# EasyEDA schematic schematic_easy_eda.json
TITLE: MDP-M01; Date: 2025-01-01; Sheet: 1/1; Drawn By: Nikolas Saf
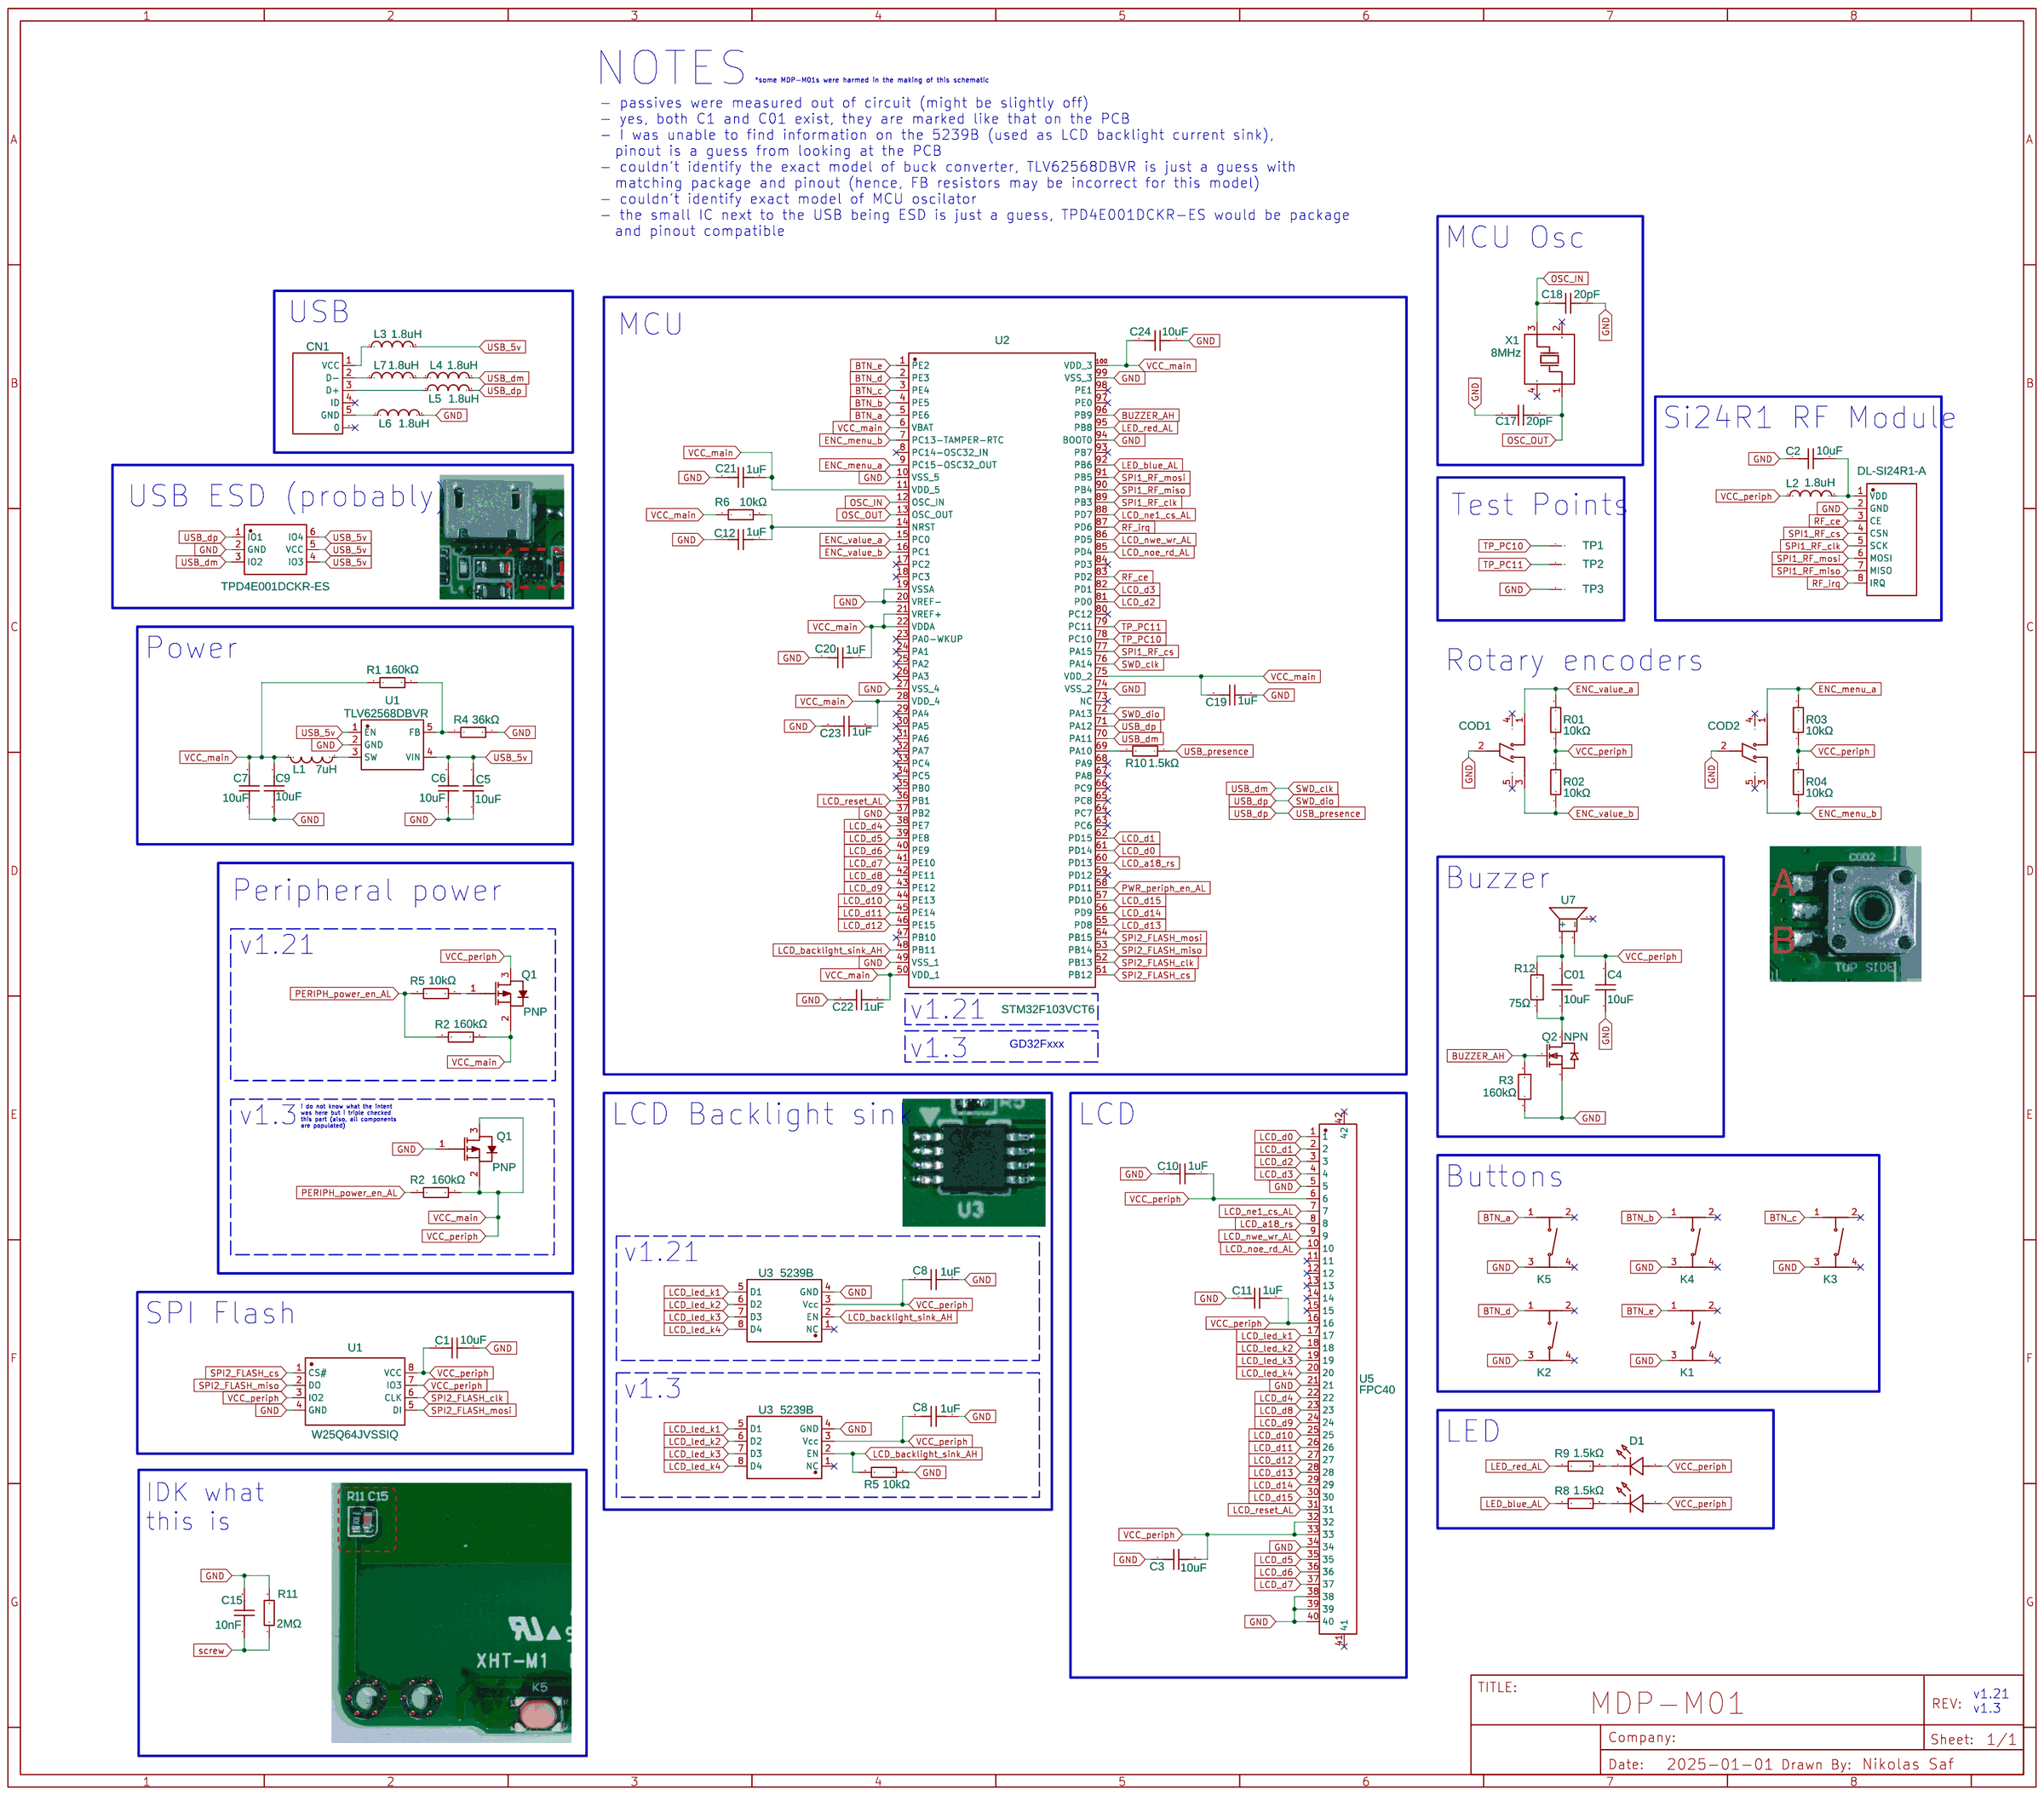
[diagram p0: schematic sheet]

## Parts
C01  10uF  [C0603]
C2  10uF  [C0603]
C3  10uF  [C0603]
C4  10uF  [C0603]
C5  10uF  [C0603]
C6  10uF  [C0603]
C7  10uF  [C0603]
C8  1uF  [C0603]
C8#2  1uF  [C0603]
C9  10uF  [C0603]
C10  1uF  [C0603]
C11  1uF  [C0603]
C12  1uF  [C0603]
C15  10nF  [C0603]
C17  20pF  [C0603]
C18  20pF  [C0603]
C19  1uF  [C0603]
C20  1uF  [C0603]
C21  1uF  [C0603]
C22  1uF  [C0603]
C23  1uF  [C0603]
C24  10uF  [C0603]
CN1  Micro USB-B 5P_C40942  [MICRO-USB-SMD_5P-P0.65-H-M_MICRO-USB-5P]
COD1  CEN808012W02  [SW-SMD_KAILH_CEN652812A02]
COD2  CEN808012W02  [SW-SMD_KAILH_CEN652812A02]
D1  XL-1615SURUBC  [LED-ARRAY-SMD_4P-L1.6-W1.5-TL-1]
D2  TPD4E001DCKR-ES  [SC-70-6_L2.0-W1.3-P0.65-LS2.1-BL]
K1  TBFF22KQR  [SW-SMD_4P-L3.5-W2.9-P1.45-LS4.7_TBFF22KQR]
K2  TBFF22KQR  [SW-SMD_4P-L3.5-W2.9-P1.45-LS4.7_TBFF22KQR]
K3  TBFF22KQR  [SW-SMD_4P-L3.5-W2.9-P1.45-LS4.7_TBFF22KQR]
K4  TBFF22KQR  [SW-SMD_4P-L3.5-W2.9-P1.45-LS4.7_TBFF22KQR]
K5  TBFF22KQR  [SW-SMD_4P-L3.5-W2.9-P1.45-LS4.7_TBFF22KQR]
L1  7uH  [L1206]
L2  1.8uH  [L1206]
L3  1.8uH  [L1206]
L4  1.8uH  [L1206]
L5  1.8uH  [L1206]
L6  1.8uH  [L1206]
L7  1.8uH  [L1206]
Q1  PNP  [SOT-23-3_L3.0-W1.7-P0.95-LS2.9-BR]
Q1#2  PNP  [SOT-23-3_L3.0-W1.7-P0.95-LS2.9-BR]
Q2  NPN  [SOT-23-3_L2.9-W1.6-P1.90-LS2.8-BR]
R01  10kΩ  [R0603]
R02  10kΩ  [R0603]
R2#2  160kΩ  [R0603]
R3  160kΩ  [R0603]
R04  10kΩ  [R0603]
R5  10kΩ  [R0603]
R5#2  10kΩ  [R0603]
R6  10kΩ  [R0603]
R8  1.5kΩ  [R0603]
R9  1.5kΩ  [R0603]
R10  1.5kΩ  [R0603]
R11  2MΩ  [R0603]
R12  75Ω  [R0603]
TP1  TEST_TESTPOINT  [TEST_TESTPOINT]
TP2  TEST_TESTPOINT  [TEST_TESTPOINT]
TP3  TEST_TESTPOINT  [TEST_TESTPOINT]
U1  W25Q64JVSSIQ  [SOP-8_L5.3-W5.3-P1.27-LS8.0-BL]
U1#2  TLV62568DBVR  [SOT-23-5_L3.0-W1.7-P0.95-LS2.8-BR]
U2  STM32F103VCT6  [LQFP-100_L14.0-W14.0-P0.50-LS16.0-BL]
U3  5239B  [SOT505-2-8P_L3.0-W3.0-P0.65-LS4.00-BR]
U3#2  5239B  [SOT505-2-8P_L3.0-W3.0-P0.65-LS4.00-BR]
U4  DL-SI24R1-A  [WIRELM-SMD_DL-SI24R1-A]
U5  FPC40  [FPC-SMD_40P-P0.50_C9900008958]
U7  4000Hz  [BUZ-SMD_L5.0-W5.5-P4.60]
X1  8MHz  [CRYSTAL-SMD_4P-L3.2-W2.5-BL-2]

## Library data of the parts
C01-C8 C8#2 C9-C12 C15 C17-C24 = CL10A106MQ8NNNC: Supplier: LCSC; Manufacturer: SAMSUNG(三星); Supplier Part: C1691; JLCPCB Part Class: Extended Part
CN1 = Micro USB-B 5P_C40942: Supplier: LCSC; Manufacturer: 精拓金; Manufacturer Part: 920-D62A2021S10100; Supplier Part: C40942; JLCPCB Part Class: Extended Part
COD1 COD2 = CEN652812A02: Contributor: lcsc; Supplier: LCSC; Supplier Part: C400282; Manufacturer: Kailh(凯华); JLCPCB Part Class: Extended Part
D1 = XL-1615SURUBC: Supplier: LCSC; Supplier Part: C965836; Manufacturer: XINGLIGHT(成兴光); JLCPCB Part Class: Extended Part; Contributor: lcsc
D2 = TPD4E001DCKR: Contributor: LCSC; Supplier: LCSC; Supplier Part: C41409243
K1-K5 = TBFF22KQR: Contributor: LCSC; Supplier: LCSC; Supplier Part: C483804; Manufacturer: 圜达; JLCPCB Part Class: Extended Part
L1-L7 = CMI321609X100KT: Supplier: LCSC; Manufacturer: FH(风华); Supplier Part: C1051; JLCPCB Part Class: Extended Part
Q1 Q1#2 = PMV32UP,215: Contributor: LCSC; Supplier: LCSC; Supplier Part: C282569; Manufacturer: Nexperia(安世); JLCPCB Part Class: Extended Part
Q2 = DMN2056U-7: Contributor: LCSC; Supplier: LCSC; Supplier Part: C332302; Manufacturer: DIODES(美台); JLCPCB Part Class: Extended Part
R01 R02 R2#2 R04 R5 R5#2 R6 R8-R11 = 0603WAF1501T5E: Supplier: LCSC; Manufacturer: UNI-ROYAL(厚声); Supplier Part: C22843; JLCPCB Part Class: Basic Part
R3 R12 = ERJ3EKF95R3V: Contributor: LCSC; Supplier: LCSC; Supplier Part: C403406; Manufacturer: PANASONIC(松下); JLCPCB Part Class: Extended Part
TP1-TP3 = TEST_TESTPOINT: Contributor: Tech Guy
U1 = W25Q64JVSSIQ: Supplier: LCSC; Manufacturer: WINBOND(华邦); Supplier Part: C83140; JLCPCB Part Class: Extended Part
U1#2 = TLV62568DBVR: Contributor: LCSC; Supplier: LCSC; Supplier Part: C163219; Manufacturer: TI(德州仪器); JLCPCB Part Class: Extended Part
U2 = STM32F103VCT6: tags: STM32; subpart_no: 2; Supplier Part: C8313; Supplier: LCSC; Manufacturer: ST(意法半导体); JLCPCB Part Class: Extended Part
U3 U3#2 = 5239B: Contributor: Nikolas_s
U4 = DL-SI24R1-A: Contributor: LCSC; Supplier: LCSC; Supplier Part: C2894788; Manufacturer: DreamLNK(骏晔科技); Manufacturer Part: DL-Si24R1-A; JLCPCB Part Class: Extended Part
U5 = FPC40: Contributor: lcsc; Supplier: LCSC; Supplier Part: C9900018161; Manufacturer: null; JLCPCB Part Class: Extended Part
U7 = MLT-5020: Supplier: LCSC; Manufacturer: 华能; Supplier Part: C94598; JLCPCB Part Class: Extended Part
X1 = TAXM8M4RFDCET2T: Contributor: LCSC; Supplier: LCSC; Supplier Part: C403948; Manufacturer: YJX(雅晶鑫); JLCPCB Part Class: Extended Part

## Nets
GND: C2.1 C3.1 C4.1 C5.2 C6.2 C7.2 C8.1 C8#2.1 C9.2 C10.1 C11.1 C12.2 C15.1 C17.1 C18.2 C19.2 C20.1 C21.1 C22.1 C23.1 C24.1 COD1.2(COM) COD2.2(COM) D2.2(GND) K1.3 K2.3 K3.3 K4.3 K5.3 L6.2 Q1#2.1(G) Q2.2(S) R3.1 R5#2.2 R11.2 TP3.1(2) U1.4(GND) U1#2.2(GND) U2.10(VSS_5) U2.19(VSSA) U2.20(VREF-) U2.27(VSS_4) U2.37(PB2) U2.49(VSS_1) U2.74(VSS_2) U2.94(BOOT0) U2.99(VSS_3) U3.4(GND) U3#2.4(GND) U4.2(GND) U5.5 U5.21 U5.34 U5.38 U5.39 U5.40
VCC_main: C3.2 C4.2 C7.1 C8.2 C8#2.2 C9.1 C10.2 C11.2 C19.1 C20.2 C21.2 C22.2 C23.2 C24.2 D1.3(A) D1.4(A) L1.2 L2.1 Q1.2(S) Q1.3(D) Q1#2.2(S) Q1#2.3(D) R01.1 R02.2 R2#2.2 R04.2 R6.1 U1.3(IO2) U1.7(IO3) U1.8(VCC) U2.6(VBAT) U2.11(VDD_5) U2.21(VREF+) U2.22(VDDA) U2.28(VDD_4) U2.50(VDD_1) U2.75(VDD_2) U2.100(VDD_3) U3.3(Vcc) U3#2.3(Vcc) U5.6 U5.16 U5.32 U5.33 U7.2(-)
BTN_a: K5.1 U2.5(PE6)
BTN_b: K4.1 U2.4(PE5)
BTN_c: K3.1 U2.3(PE4)
BTN_d: K2.1 U2.2(PE3)
BTN_e: K1.1 U2.1(PE2)
BUZZER_AH: Q2.1(G) R3.2 U2.96(PB9)
ENC_menu_a: COD2.1(A) U2.9(PC15-OSC32_OUT)
ENC_menu_b: COD2.3(B) R04.1 U2.7(PC13-TAMPER-RTC)
ENC_value_a: COD1.1(A) R01.2 U2.15(PC0)
ENC_value_b: COD1.3(B) R02.1 U2.16(PC1)
LCD_a18_rs: U2.60(PD13) U5.8
LCD_backlight_sink_AH: R5#2.1 U2.48(PB11) U3.2(EN) U3#2.2(EN)
LCD_d0: U2.61(PD14) U5.1
LCD_d1: U2.62(PD15) U5.2
LCD_d2: U2.81(PD0) U5.3
LCD_d3: U2.82(PD1) U5.4
LCD_d4: U2.38(PE7) U5.22
LCD_d5: U2.39(PE8) U5.35
LCD_d6: U2.40(PE9) U5.36
LCD_d7: U2.41(PE10) U5.37
LCD_d8: U2.42(PE11) U5.23
LCD_d9: U2.43(PE12) U5.24
LCD_d10: U2.44(PE13) U5.25
LCD_d11: U2.45(PE14) U5.26
LCD_d12: U2.46(PE15) U5.27
LCD_d13: U2.55(PD8) U5.28
LCD_d14: U2.56(PD9) U5.29
LCD_d15: U2.57(PD10) U5.30
LCD_led_k1: U3.5(D1) U3#2.5(D1) U5.17
LCD_led_k2: U3.6(D2) U3#2.6(D2) U5.18
LCD_led_k3: U3.7(D3) U3#2.7(D3) U5.19
LCD_led_k4: U3.8(D4) U3#2.8(D4) U5.20
LCD_ne1_cs_AL: U2.88(PD7) U5.7
LCD_noe_rd_AL: U2.85(PD4) U5.10
LCD_nwe_wr_AL: U2.86(PD5) U5.9
LCD_reset_AL: U2.36(PB1) U5.31
LED_blue_AL: R8.1 U2.92(PB6)
LED_red_AL: R9.1 U2.95(PB8)
OSC_IN: C18.1 U2.12(OSC_IN) X1.3(OSC2)
OSC_OUT: C17.2 U2.13(OSC_OUT) X1.1(OSC1)
PERIPH_power_en_AL: R2#2.1 R5.1
PWR_periph_en_AL: U2.58(PD11)
RF_ce: U2.83(PD2) U4.3(CE)
RF_irq: U2.87(PD6) U4.8(IRQ)
screw: C15.2 R11.1
SPI1_RF_clk: U2.89(PB3) U4.5(SCK)
SPI1_RF_cs: U2.77(PA15) U4.4(CSN)
SPI1_RF_miso: U2.90(PB4) U4.7(MISO)
SPI1_RF_mosi: U2.91(PB5) U4.6(MOSI)
SPI2_FLASH_clk: U1.6(CLK) U2.52(PB13)
SPI2_FLASH_cs: U1.1(CS#) U2.51(PB12)
SPI2_FLASH_miso: U1.2(DO) U2.53(PB14)
SPI2_FLASH_mosi: U1.5(DI) U2.54(PB15)
SWD_clk: D2.3(IO2) L4.2 U2.70(PA11) U2.76(PA14)
SWD_dio: D2.1(IO1) L5.2 R10.1 U2.71(PA12) U2.72(PA13)
TP_PC10: TP1.1(2) U2.78(PC10)
TP_PC11: TP2.1(2) U2.79(PC11)
USB_5v: C5.1 C6.1 D2.4(IO3) D2.5(VCC) D2.6(IO4) L3.2 U1#2.1(EN) U1#2.4(VIN)
Net-(C01-1): C01.1 Q2.3(D) R12.1
Net-(C01-2): C01.2 R12.2 U7.1(+)
Net-(C2-2): C2.2 L2.2 U4.1(VDD)
Net-(C12-1): C12.1 R6.2 U2.14(NRST)
Net-(CN1-1): CN1.1(VCC) L3.1
Net-(CN1-2): CN1.2(D-) L7.1
Net-(CN1-3): CN1.3(D+) L5.1
Net-(CN1-5): CN1.5(GND) L6.1
Net-(D1-1): D1.1(K) R9.2
Net-(D1-2): D1.2(K) R8.2
Net-(L1-1): L1.1 U1#2.3(SW)
Net-(L4-1): L4.1 L7.2
Net-(Q1-1): Q1.1(G) R5.2
Net-(R10-2): R10.2 U2.69(PA10)

Not connected (* = marked no-connect by the designer): CN1 0* 4(ID)*; COD1 4* 5*; COD2 4* 5*; K1 2* 4*; K2 2* 4*; K3 2* 4*; K4 2* 4*; K5 2* 4*; U1#2 5(FB); U2 8(PC14-OSC32_IN)* 17(PC2)* 18(PC3)* 23(PA0-WKUP)* 24(PA1)* 25(PA2)* 26(PA3)* 29(PA4)* 30(PA5)* 31(PA6)* 32(PA7)* 33(PC4)* 34(PC5)* 35(PB0)* 47(PB10)* 59(PD12)* 63(PC6)* 64(PC7)* 65(PC8)* 66(PC9)* 67(PA8)* 68(PA9)* 73(NC)* 80(PC12)* 84(PD3)* 93(PB7)* 97(PE0)* 98(PE1)*; U3 1(NC)*; U3#2 1(NC)*; U5 11* 12* 13* 14* 15* 41* 42*; U7 3(NC)*; X1 2(GND)* 4(GND)*

## Notes on the sheet
- NOTES
- *some MDP-M01s were harmed in the making of this schematic
- - passives were measured out of circuit (might be slightly off)
  - yes, both C1 and C01 exist, they are marked like that on the PCB
  - I was unable to find information on the 5239B (used as LCD backlight current sink),
    pinout is a guess from looking at the PCB
  - couldn't identify the exact model of buck converter, TLV62568DBVR is just a guess with
    matching package and pinout (hence, FB resistors may be incorrect for this model)
  - couldn't identify exact model of MCU oscilator
  - the small IC next to the USB being ESD is just a guess, TPD4E001DCKR-ES would be package
    and pinout compatible
- MCU Osc
- USB
- MCU
- Si24R1 RF Module
- USB ESD (probably)
- Test Points
- Power
- Rotary encoders
- Buzzer
- Peripheral power
- v1.21
- v1.21
- v1.3
- GD32Fxxx
- LCD Backlight sink
- LCD
- v1.3
- i do not know what the intent
  was here but i triple checked
  this part (also, all components
  are populated)
- Buttons
- v1.21
- SPI Flash
- v1.3
- LED
- IDK what
  this is
- v1.21
  v1.3
